# Altium schematic sheet Esp32.SchDoc
size A; SheetNumber: 5; SheetTotal: 5
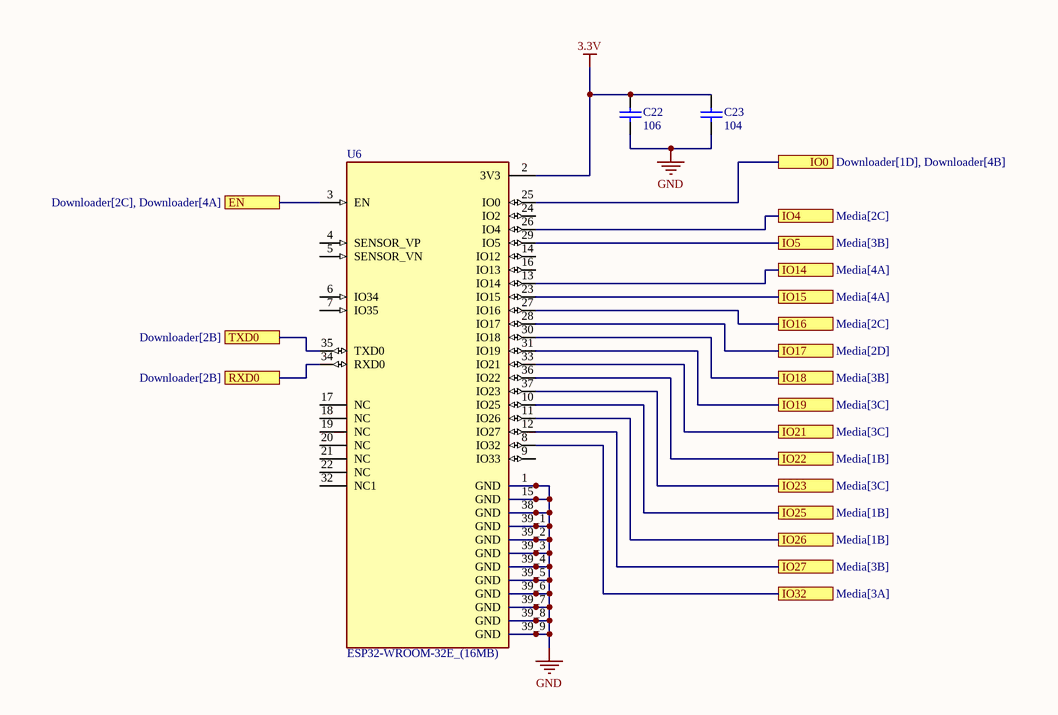
[diagram p0: Esp32.SchDoc]

## Parts
C22  106  [tu 0805]
C23  104  [tu 0805]
U6  ESP32-WROOM-32E_(16MB)  [XCVR_ESP32-WROOM-32E_(16MB)]

## Ports
EN (see Downloader[2C], Downloader[4A]), IO0 (see Downloader[1D], Downloader[4B]), IO4 (see Media[2C]), IO5 (see Media[3B]), IO14 (see Media[4A]), IO15 (see Media[4A]), IO16 (see Media[2C]), IO17 (see Media[2D]), IO18 (see Media[3B]), IO19 (see Media[3C]), IO21 (see Media[3C]), IO22 (see Media[1B]), IO23 (see Media[3C]), IO25 (see Media[1B]), IO26 (see Media[1B]), IO27 (see Media[3B]), IO32 (see Media[3A]), RXD0 (see Downloader[2B]), TXD0 (see Downloader[2B])

## Nets
3.3V: C22.1 C23.1 U6.2(3V3)
GND: C22.2 C23.2 U6.1(GND) U6.15(GND) U6.38(GND) U6.39_1(GND) U6.39_2(GND) U6.39_3(GND) U6.39_4(GND) U6.39_5(GND) U6.39_6(GND) U6.39_7(GND) U6.39_8(GND) U6.39_9(GND)
EN: U6.3(EN) ; port EN
IO0: U6.25(IO0) ; port IO0
IO4: U6.26(IO4) ; port IO4
IO5: U6.29(IO5) ; port IO5
IO14: U6.13(IO14) ; port IO14
IO15: U6.23(IO15) ; port IO15
IO16: U6.27(IO16) ; port IO16
IO17: U6.28(IO17) ; port IO17
IO18: U6.30(IO18) ; port IO18
IO19: U6.31(IO19) ; port IO19
IO21: U6.33(IO21) ; port IO21
IO22: U6.36(IO22) ; port IO22
IO23: U6.37(IO23) ; port IO23
IO25: U6.10(IO25) ; port IO25
IO26: U6.11(IO26) ; port IO26
IO27: U6.12(IO27) ; port IO27
IO32: U6.8(IO32) ; port IO32
RXD0: U6.34(RXD0) ; port RXD0
TXD0: U6.35(TXD0) ; port TXD0

Not connected (* = marked no-connect by the designer): U6 4(SENSOR_VP) 5(SENSOR_VN) 6(IO34) 7(IO35) 9(IO33) 14(IO12) 16(IO13) 17(NC) 18(NC) 19(NC) 20(NC) 21(NC) 22(NC) 24(IO2) 32(NC1)

## Library data of the parts
C22 C23 = Tu 0805 106 16V 10%: Dán; Ten_Linh_Kien: Tụ 0805 106-10uF 10% 16V; So_Chan: 2; Don_Vi: Con; Ma_Hang: MH004553; Chung_Loai: Dán; Kieu_Chan: *
U6 = ESP32-WROOM-32E_(16MB): Bluetooth, WiFi 802.11b/g/n, Bluetooth v4.2 +EDR, Class 1, 2 and 3 Transceiver Module 2.4GHz ~ 2.5GHz Integrated, Trace Surface Mount; MP: ESP32-WROOM-32E (16MB); MF: Espressif Systems; Price: None; Availability: Not in stock; Package: None; Value: *; SnapEDA_Link: https://www.snapeda.com/parts/ESP32-WROOM-32E%20(16MB)/Espressif+Systems/view-part/?ref=snap; Check_prices: https://www.snapeda.com/parts/ESP32-WROOM-32E%20(16MB)/Espressif+Systems/view-part/?ref=eda